# Altium schematic sheet Linear_camera_schematic.SchDoc
size A4
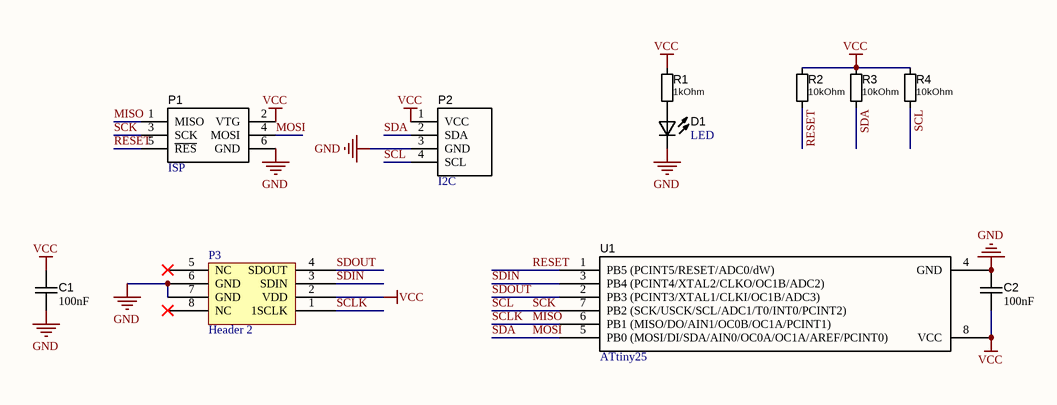
[diagram p0: Linear_camera_schematic.SchDoc]

## Parts
C1  value 100nF  [C/0805]  (hidden comment: C)
C2  value 100nF  [C/0805]  (hidden comment: C)
D1  LED  [LED-2012[0805]]
P1  ISP  [HEADER2X3]
P2  I2C  [TYCO/215079-4]
P3  Header 2  [TSL3301CL]
R1  1kOhm  [R/0805]
R2  10kOhm  [R/0805]
R3  10kOhm  [R/0805]
R4  10kOhm  [R/0805]
U1  ATtiny25  [SOIC8 - ATtiny25]

## Nets
GND: C1.1 C2.2 D1.K P1.6(GND) P2.3(GND) P3.6(GND) P3.7(GND) U1.4(GND)
VCC: C1.2 C2.1 P1.2(VTG) P2.1(VCC) P3.2(VDD) R1.2 R2.2 R3.2 R4.2 U1.8(VCC)
MISO: P1.1(MISO) P3.1(1SCLK) U1.6(PB1_(MISO/DO/AIN1/OC0B/OC1A/PCINT1))  [also labelled SCLK]
MOSI: P1.4(MOSI) P2.2(SDA) R3.1 U1.5(PB0_(MOSI/DI/SDA/AIN0/OC0A/OC1A/AREF/PCINT0))  [also labelled SDA]
RESET: P1.5(~{RES}) R2.1 U1.1(PB5_(PCINT5/RESET/ADC0/dW))
SCK: P1.3(SCK) P2.4(SCL) R4.1 U1.7(PB2_(SCK/USCK/SCL/ADC1/T0/INT0/PCINT2))  [also labelled SCL]
SDIN: P3.3(SDIN) U1.3(PB4_(PCINT4/XTAL2/CLKO/OC1B/ADC2))
SDOUT: P3.4(SDOUT) U1.2(PB3_(PCINT3/XTAL1/CLKI/OC1B/ADC3))
NetD1_A: D1.A R1.1

Not connected (* = marked no-connect by the designer): P3 5(NC)* 8(NC)*

## Library data of the parts
C1 C2 = C: Capacitor; Published: 8-Jun-2000; LatestRevisionDate: 17-Jul-2002; LatestRevisionNote: Re-released for DXP Platform.; PackageReference: RAD-0.3; Publisher: Altium Limited
P1 = AVR ISP 6pin: LatestRevisionDate: 17-Jul-2002; LatestRevisionNote: Re-released for DXP Platform.; Publisher: Altium Limited
P2 = Micromatch-I2C: Micromatch I2C Connector
P3 = TSL3301CL: Header, 2-Pin; LatestRevisionDate: 17-Jul-2002; LatestRevisionNote: Re-released for DXP Platform.; Publisher: Altium Limited
R1-R4 = R: Resistor; Published: 8-Jun-2000; LatestRevisionDate: 17-Jul-2002; LatestRevisionNote: Re-released for DXP Platform.; PackageReference: AXIAL-0.4; Publisher: Altium Limited
  R1: Value: 1kOhm
  R2-R4: Value: 10kOhm
D1 = LED: Published: 8-Jun-2000; LatestRevisionDate: 08-Jul-2005; LatestRevisionNote: Mech Layer 1 removed.; PackageReference: LED-0; Publisher: Altium Limited